# EAGLE design codec_CS42448(rev_A) (EAGLE 9.6.2)

## Sheet 1 of 4
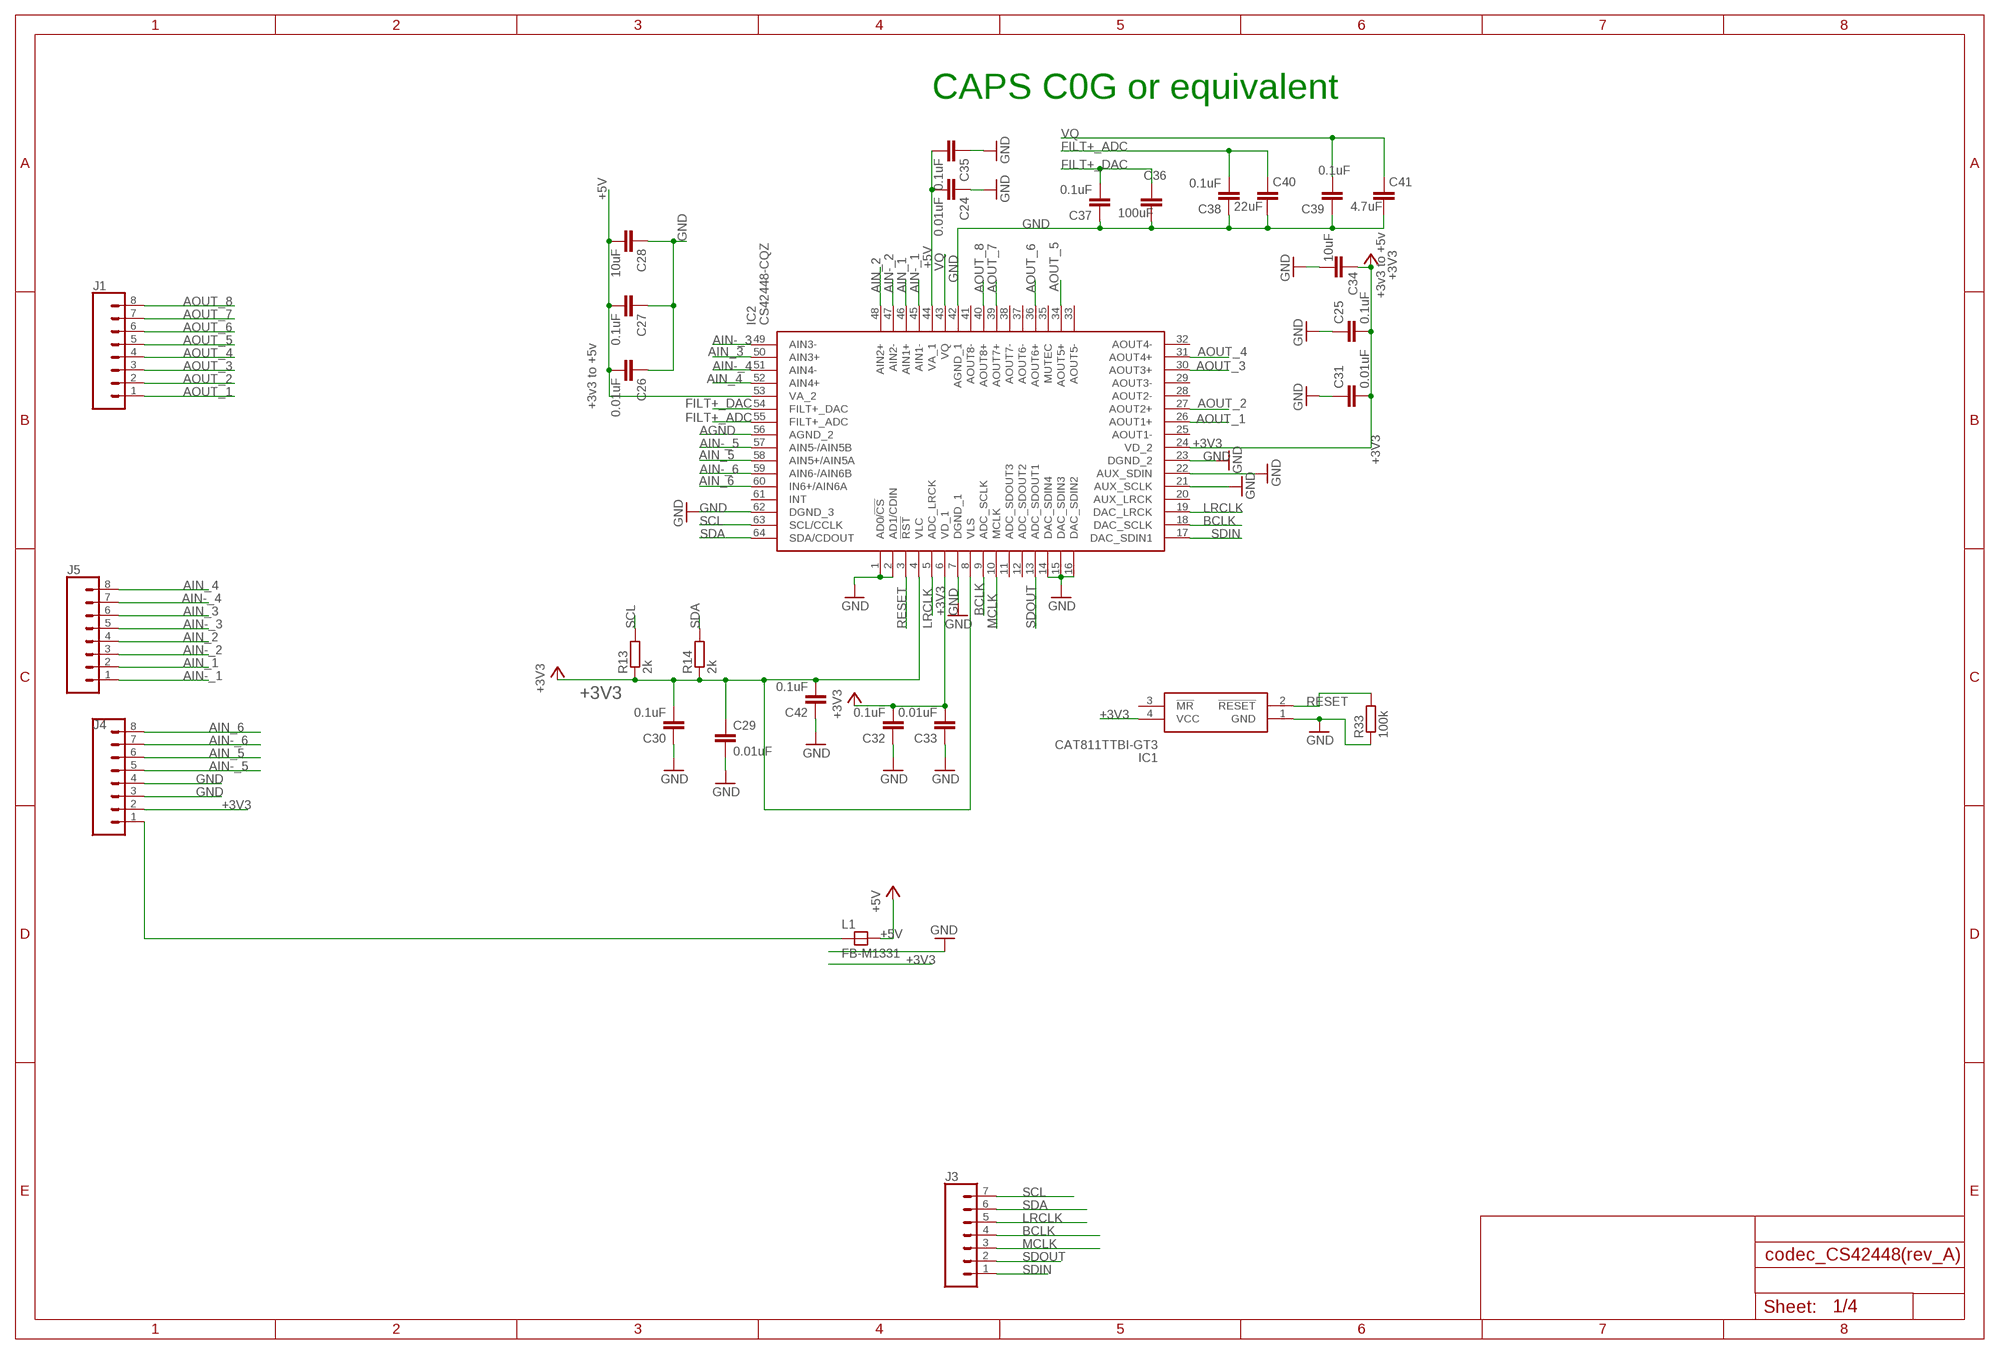
[diagram p0: schematic, sheet 1]

### Parts
C24  0.01uF  C-EUC0805  [C0805]
C25  0.1uF  C-EUC0603  [C0603]
C26  0.01uF  C-EUC0805  [C0805]
C27  0.1uF  C-EUC0603  [C0603]
C28  10uF  C-EUC0805  [C0805]
C29  0.01uF  C-EUC0805  [C0805]
C30  0.1uF  C-EUC0603  [C0603]
C31  0.01uF  C-EUC0805  [C0805]
C32  0.1uF  C-EUC0603  [C0603]
C33  0.01uF  C-EUC0805  [C0805]
C34  10uF  C-EUC0805  [C0805]
C35  0.1uF  C-EUC0603  [C0603]
C36  100uF  C-EUC1206  [C1206]
C37  0.1uF  C-EUC0603  [C0603]
C38  0.1uF  C-EUC0603  [C0603]
C39  0.1uF  C-EUC0603  [C0603]
C40  22uF  C-EUC0805  [C0805]
C41  4.7uF  C-EUC0805  [C0805]
C42  0.1uF  C-EUC0805  [C0805]
IC1  CAT811TTBI-GT3  [4-PIN-SOT-143(BI-SUFFIX-CASE-5]
IC2  CS42448-CQZ  [QFP50P1200X1200X160-64N]
J1  CONN_08"  [1X08]
J3  CONN_07  [1X07]
J4  CONN_08"  [1X08]
J5  CONN_08"  [1X08]
L1  FB-M1331  [M1331]
R13  2k  R-EU_R0603  [R0603]
R14  2k  R-EU_R0603  [R0603]
R33  100k  R-EU_R0603  [R0603]

### Nets
+3V3: C25.2 C29.1 C30.2 C31.2 C32.2 C33.2 C34.1 C42.2 IC1.4(VCC) IC2.4(VLC) IC2.6(VD_1) IC2.8(VLS) IC2.24(VD_2) J4.2 R13.1 R14.1
+5V: C24.2 C26.2 C27.2 C28.2 C35.2 IC2.44(VA_1) IC2.53(VA_2) L1.2
AGND: IC2.56(AGND_2)
AIN-_1: IC2.45(AIN1-) J5.1
AIN-_2: IC2.47(AIN2-) J5.3
AIN-_3: IC2.49(AIN3-) J5.5
AIN-_4: IC2.51(AIN4-) J5.7
AIN-_5: IC2.57(AIN5-/AIN5B) J4.5
AIN-_6: IC2.59(AIN6-/AIN6B) J4.7
AIN_1: IC2.46(AIN1+) J5.2
AIN_2: IC2.48(AIN2+) J5.4
AIN_3: IC2.50(AIN3+) J5.6
AIN_4: IC2.52(AIN4+) J5.8
AIN_5: IC2.58(AIN5+/AIN5A) J4.6
AIN_6: IC2.60(IN6+/AIN6A) J4.8
AOUT_1: IC2.26(AOUT1+) J1.1
AOUT_2: IC2.27(AOUT2+) J1.2
AOUT_3: IC2.30(AOUT3+) J1.3
AOUT_4: IC2.31(AOUT4+) J1.4
AOUT_5: IC2.34(AOUT5+) J1.5
AOUT_6: IC2.36(AOUT6+) J1.6
AOUT_7: IC2.39(AOUT7+) J1.7
AOUT_8: IC2.40(AOUT8+) J1.8
BCLK: IC2.9(ADC_SCLK) IC2.18(DAC_SCLK) J3.4
FILT+_ADC: C38.2 C40.1 IC2.55(FILT+_ADC)
FILT+_DAC: C36.1 C37.2 IC2.54(FILT+_DAC)
GND: C24.1 C25.1 C26.1 C27.1 C28.1 C29.2 C30.1 C31.1 C32.1 C33.1 C34.2 C35.1 C36.2 C37.1 C38.1 C39.1 C40.2 C41.2 C42.1 IC1.1(GND) IC2.1(AD0/!CS) IC2.2(AD1/CDIN) IC2.7(DGND_1) IC2.14(DAC_SDIN4) IC2.15(DAC_SDIN3) IC2.16(DAC_SDIN2) IC2.21(AUX_SCLK) IC2.22(AUX_SDIN) IC2.23(DGND_2) IC2.42(AGND_1) IC2.62(DGND_3) J4.3 J4.4 R33.1
LRCLK: IC2.5(ADC_LRCK) IC2.19(DAC_LRCK) J3.5
MCLK: IC2.10(MCLK) J3.3
N$1: J4.1 L1.1
RESET: IC1.2(!RESET) IC2.3(!RST) R33.2
SCL: IC2.63(SCL/CCLK) J3.7 R13.2
SDA: IC2.64(SDA/CDOUT) J3.6 R14.2
SDIN: IC2.17(DAC_SDIN1) J3.1
SDOUT: IC2.13(ADC_SDOUT1) J3.2
VQ: C39.2 C41.1 IC2.43(VQ)
Unconnected: IC1.3(!MR) IC2.11(ADC_SDOUT3) IC2.12(ADC_SDOUT2) IC2.20(AUX_LRCK) IC2.25(AOUT1-) IC2.28(AOUT2-) IC2.29(AOUT3-) IC2.32(AOUT4-) IC2.33(AOUT5-) IC2.35(MUTEC) IC2.37(AOUT6-) IC2.38(AOUT7-) IC2.41(AOUT8-) IC2.61(INT)

### Notes on the sheet
- CAPS C0G or equivalent
- +3v3 to +5v
- +3v3 to +5v

## Sheet 2 of 4
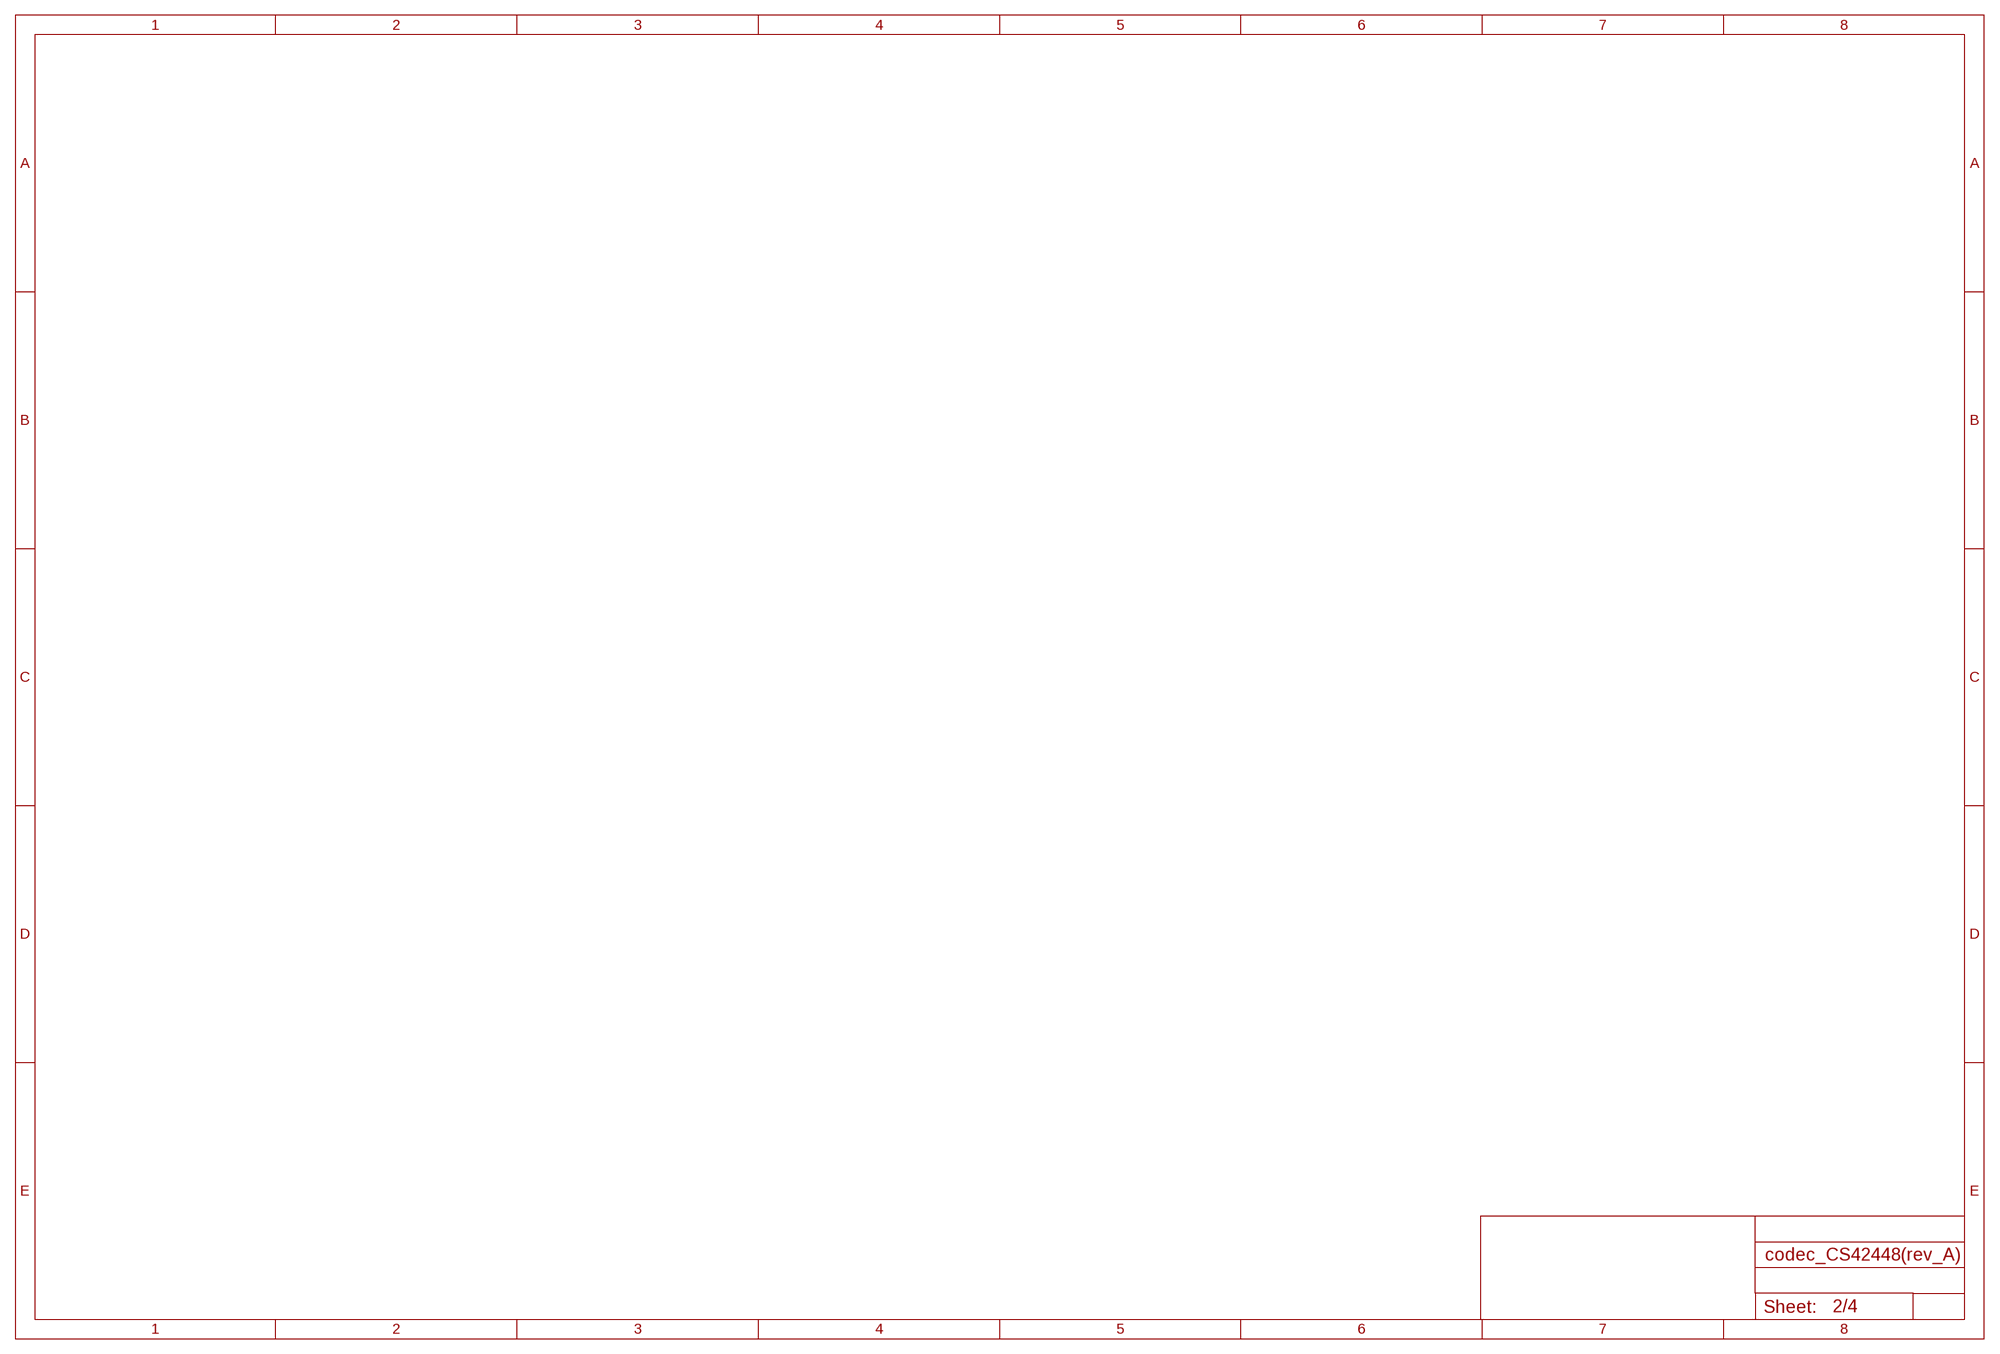
[diagram p1: schematic, sheet 2]

## Sheet 3 of 4
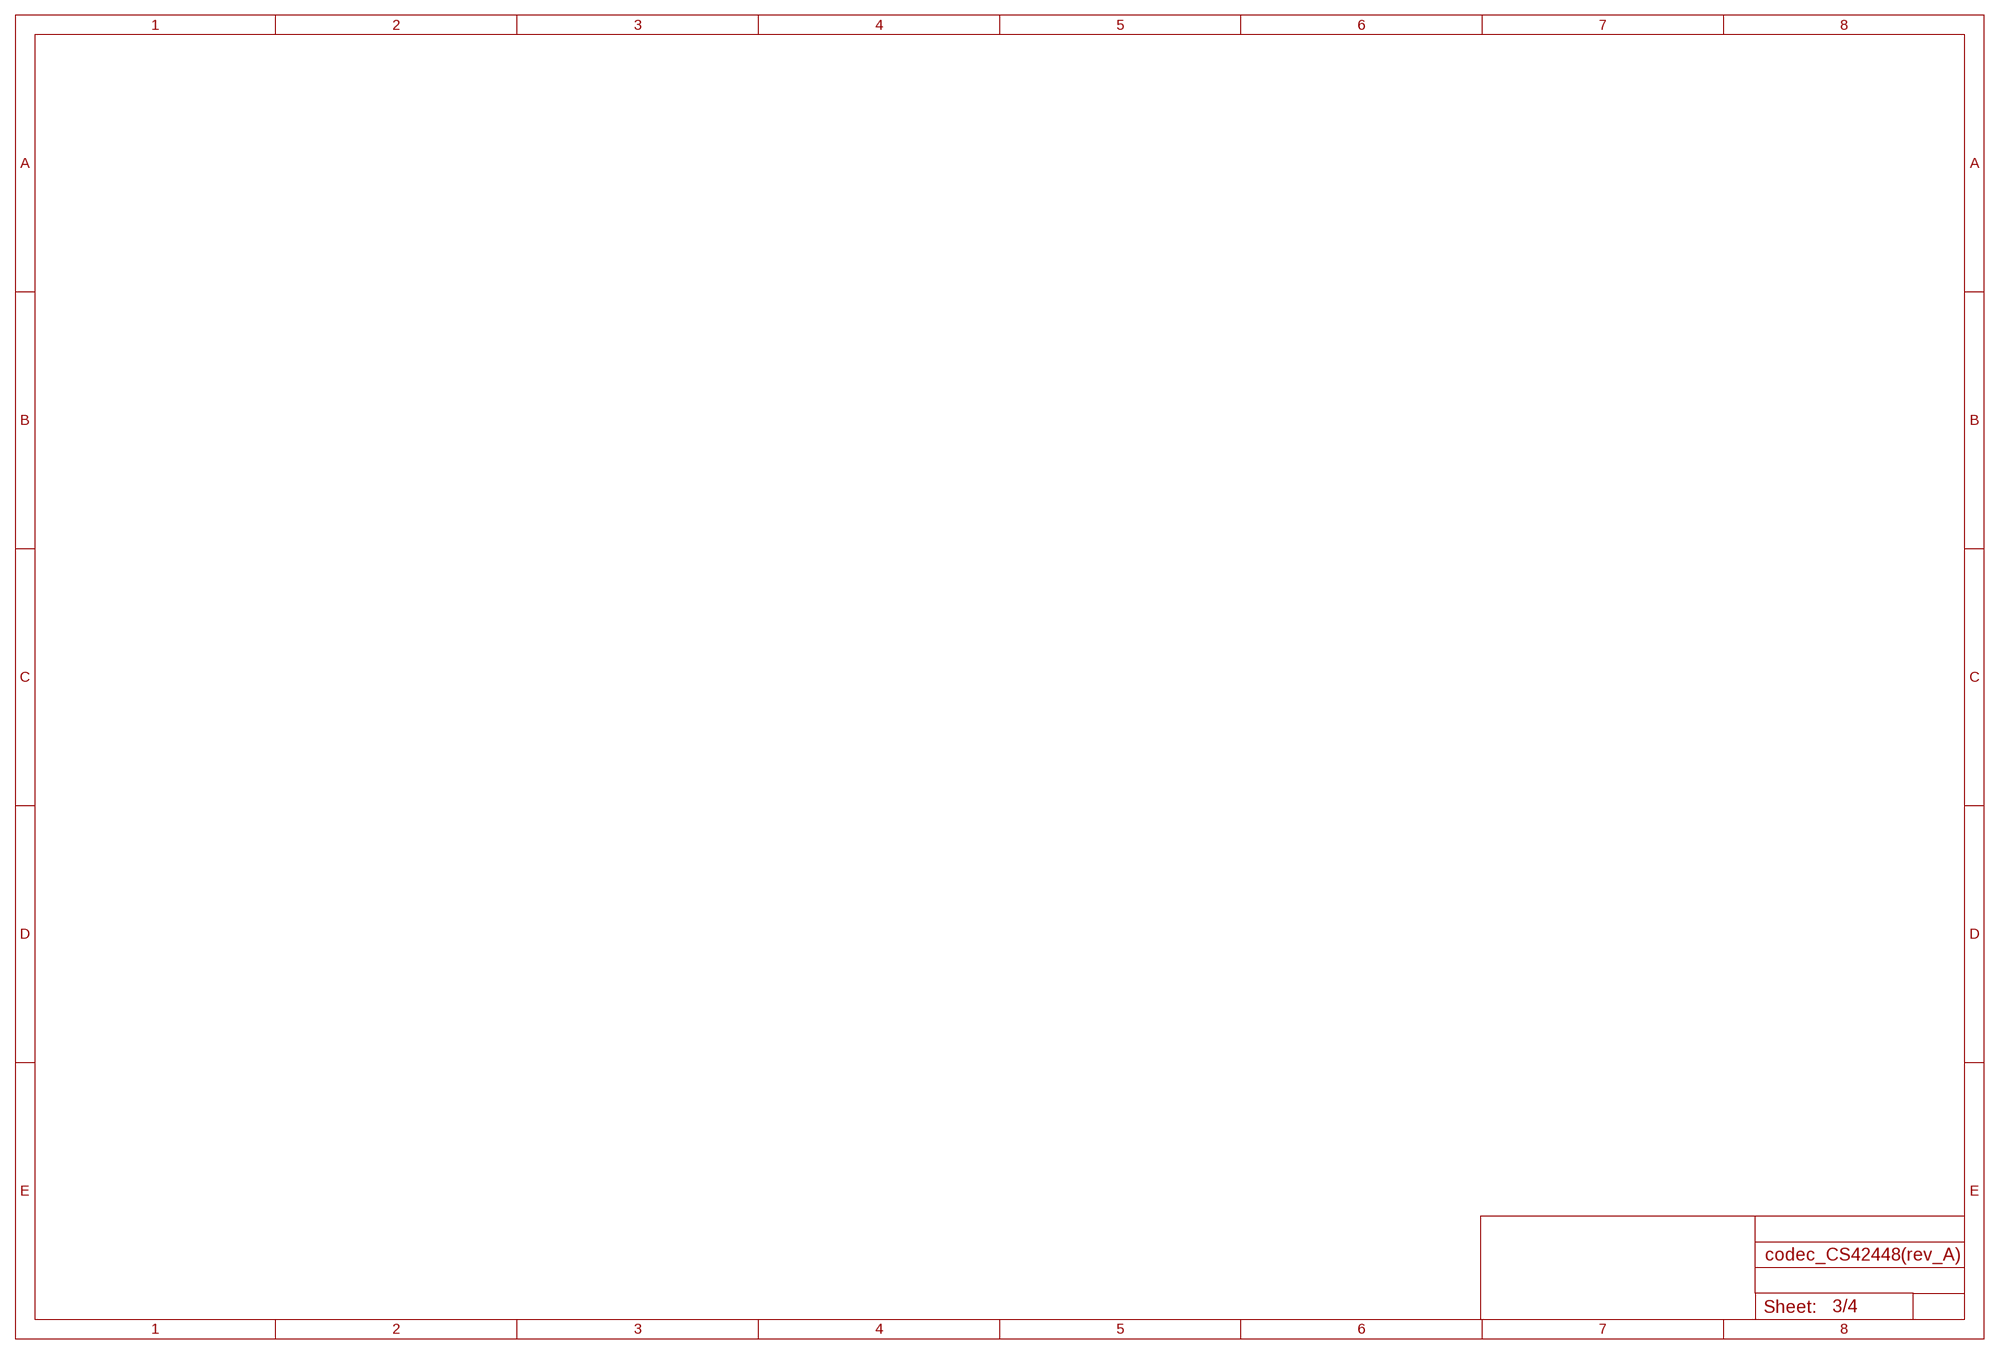
[diagram p2: schematic, sheet 3]

## Sheet 4 of 4
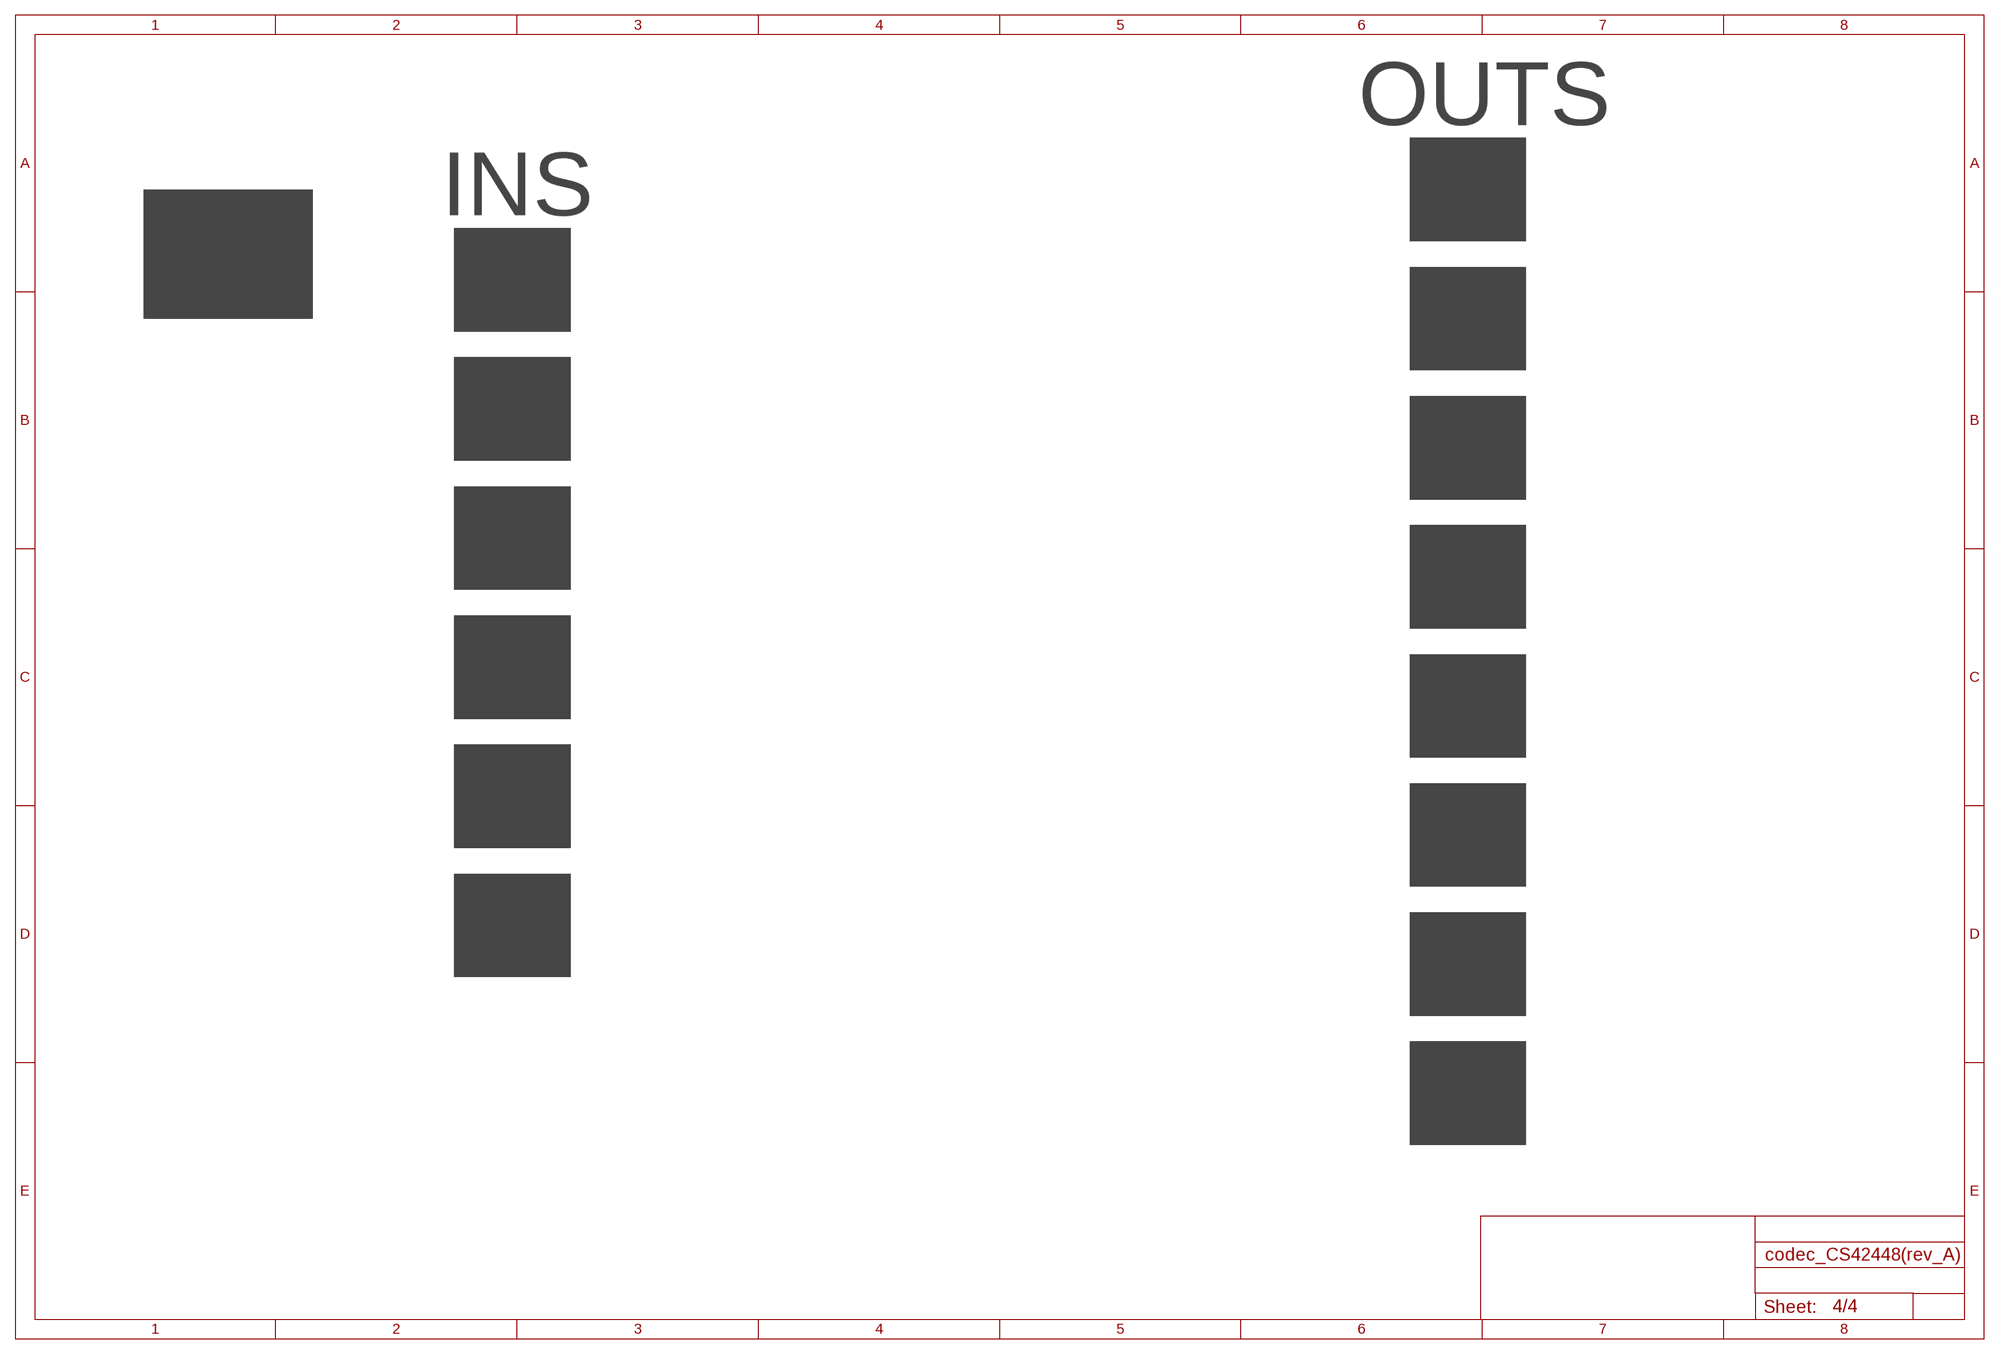
[diagram p3: schematic, sheet 4]

### Notes on the sheet
- OUTS
- INS

## Library data of the parts
C24-C42 = rcl:C-EU: CAPACITOR, European symbol; SPICEPREFIX: C
IC1 = MusicThingModular:CAT811TTBI-GT3: uP PSU Supervisory IC Vth=3.075V SOT-143 ON Semiconductor CAT811TTBI-GT3, Voltage Supervisor 2.5V, 3V, 3.3V, 5V, Reset Input, 4-Pin SOT-143 Source: Datasheet <http://www.onsemi.com/pub/Collateral/CAT811-D.PDF>; ARROW_PART_NUMBER: CAT811TTBI-GT3; ARROW_PRICE-STOCK: https://www.arrow.com/en/products/cat811ttbi-gt3/on-semiconductor?region=nac; DESCRIPTION: uP PSU Supervisory IC Vth=3.075V SOT-143 ON Semiconductor CAT811TTBI-GT3, Voltage Supervisor 2.5V, 3V, 3.3V, 5V, Reset Input, 4-Pin SOT-143; HEIGHT: mm; MANUFACTURER_NAME: ON Semiconductor; MANUFACTURER_PART_NUMBER: CAT811TTBI-GT3; MOUSER_PART_NUMBER: 698-CAT811TTBI-GT3; MOUSER_PRICE-STOCK: https://www.mouser.co.uk/ProductDetail/onsemi/CAT811TTBI-GT3?qs=uDmhV2jwPRcoUWDTAizusg%3D%3D
IC2 = MusicThingModular:CS42448-CQZ: Interface - CODECs 6-In 8-Out CODEC 108 dB 192 kHz Source: Datasheet <http://www.mouser.com/datasheet/2/76/CS42448_F5-1141475.pdf>; DESCRIPTION: Interface - CODECs 6-In 8-Out CODEC 108 dB 192 kHz; HEIGHT: 1.6mm; MANUFACTURER_NAME: Cirrus Logic; MANUFACTURER_PART_NUMBER: CS42448-CQZ; MOUSER_PART_NUMBER: 777-CS42448-CQZ; MOUSER_PRICE-STOCK: https://www.mouser.co.uk/ProductDetail/Cirrus-Logic/CS42448-CQZ?qs=bUPhaerQQeGUnfo%252BYCcmZw%3D%3D
J1 J4 J5 = SparkFun-Connectors:CONN_08: Multi connection point. Often used as Generic Header-pin footprint for 0.1 inch spaced/style header connections On any of the 0.1 inch spaced packages, you can populate with these: Break Away Headers - Straight <https://www.sparkfun.com/products/116> (PRT-00116) Break Away Male Headers - Right Angle <https://www.sparkfun.com/products/553> (PRT-00553) Female Headers <https://www.sparkfun.com/products/115> (PRT-00115) Break Away Headers - Machine Pin <https://www.sparkfun.com/products/117> (PRT-00117) Break Away Female Headers - Swiss Machine Pin <https://www.sparkfun.com/products/743> (PRT-00743) Arduino Stackable Header - 8 Pin <https://www.sparkfun.com/products/9279> (PRT-09279) For SCREWTERMINALS and SPRING TERMINALS visit here: Screw Terimnals on SparkFun.com <https://www.sparkfun.com/search/results?term=Screw+Terminals> (5mm/3.5mm/2.54mm spacing) This device is also useful as a general connection point to wire up your design to another part of your project. Our various solder wires solder well into these plated through hole pads. Hook-Up Wire - Assortment (Stranded, 22 AWG) <https://www.sparkfun.com/products/11375> (PRT-11375) Hook-Up Wire - Assortment (Solid Core, 22 AWG) <https://www.sparkfun.com/products/11367> (PRT-11367) View the entire wire category on our website here <https://www.sparkfun.com/categories/141> Special notes: Molex polarized connector foot print use with SKU : PRT-08231 with associated crimp pins and housings. 1MM SMD Version SKU: PRT-10208 NOTES ON THE VARIANTS LOCK and LOCK_LONGPADS... This footprint was designed to help hold the alignment of a through-hole component (i.e. 6-pin header) while soldering it into place. You may notice that each hole has been shifted either up or down by 0.005 of an inch from it's more standard position (which is a perfectly straight line). This slight alteration caused the pins (the squares in the middle) to touch the edges of the holes. Because they are alternating, it causes a "brace" to hold the component in place. 0.005 has proven to be the perfect amount of "off-center" position when using our standard breakaway headers. Although looks a little odd when you look at the bare footprint, once you have a header in there, the alteration is very hard to notice. Also,if you push a header all the way into place, it is covered up entirely on the bottom side.; PROD_ID: CONN-08438
J3 = SparkFun-Connectors:CONN_07: Multi connection point. Often used as Generic Header-pin footprint for 0.1 inch spaced/style header connections On any of the 0.1 inch spaced packages, you can populate with these: Break Away Headers - Straight <https://www.sparkfun.com/products/116> (PRT-00116) Break Away Male Headers - Right Angle <https://www.sparkfun.com/products/553> (PRT-00553) Female Headers <https://www.sparkfun.com/products/115> (PRT-00115) Break Away Headers - Machine Pin <https://www.sparkfun.com/products/117> (PRT-00117) Break Away Female Headers - Swiss Machine Pin <https://www.sparkfun.com/products/743> (PRT-00743) For SCREWTERMINALS and SPRING TERMINALS visit here: Screw Terimnals on SparkFun.com <https://www.sparkfun.com/search/results?term=Screw+Terminals> (5mm/3.5mm/2.54mm spacing) This device is also useful as a general connection point to wire up your design to another part of your project. Our various solder wires solder well into these plated through hole pads. Hook-Up Wire - Assortment (Stranded, 22 AWG) <https://www.sparkfun.com/products/11375> (PRT-11375) Hook-Up Wire - Assortment (Solid Core, 22 AWG) <https://www.sparkfun.com/products/11367> (PRT-11367) View the entire wire category on our website here <https://www.sparkfun.com/categories/141> Special notes: Molex polarized connector foot print use with SKU : PRT-08231 with associated crimp pins and housings. 1MM SMD Version SKU: PRT-10208 NOTES ON THE VARIANTS LOCK and LOCK_LONGPADS... This footprint was designed to help hold the alignment of a through-hole component (i.e. 6-pin header) while soldering it into place. You may notice that each hole has been shifted either up or down by 0.005 of an inch from it's more standard position (which is a perfectly straight line). This slight alteration caused the pins (the squares in the middle) to touch the edges of the holes. Because they are alternating, it causes a "brace" to hold the component in place. 0.005 has proven to be the perfect amount of "off-center" position when using our standard breakaway headers. Although looks a little odd when you look at the bare footprint, once you have a header in there, the alteration is very hard to notice. Also,if you push a header all the way into place, it is covered up entirely on the bottom side.
L1 = inductors-jwmiller:FB: FERRITE BEAD
R13 R14 R33 = rcl:R-EU_: RESISTOR, European symbol; SPICEPREFIX: R

## Board
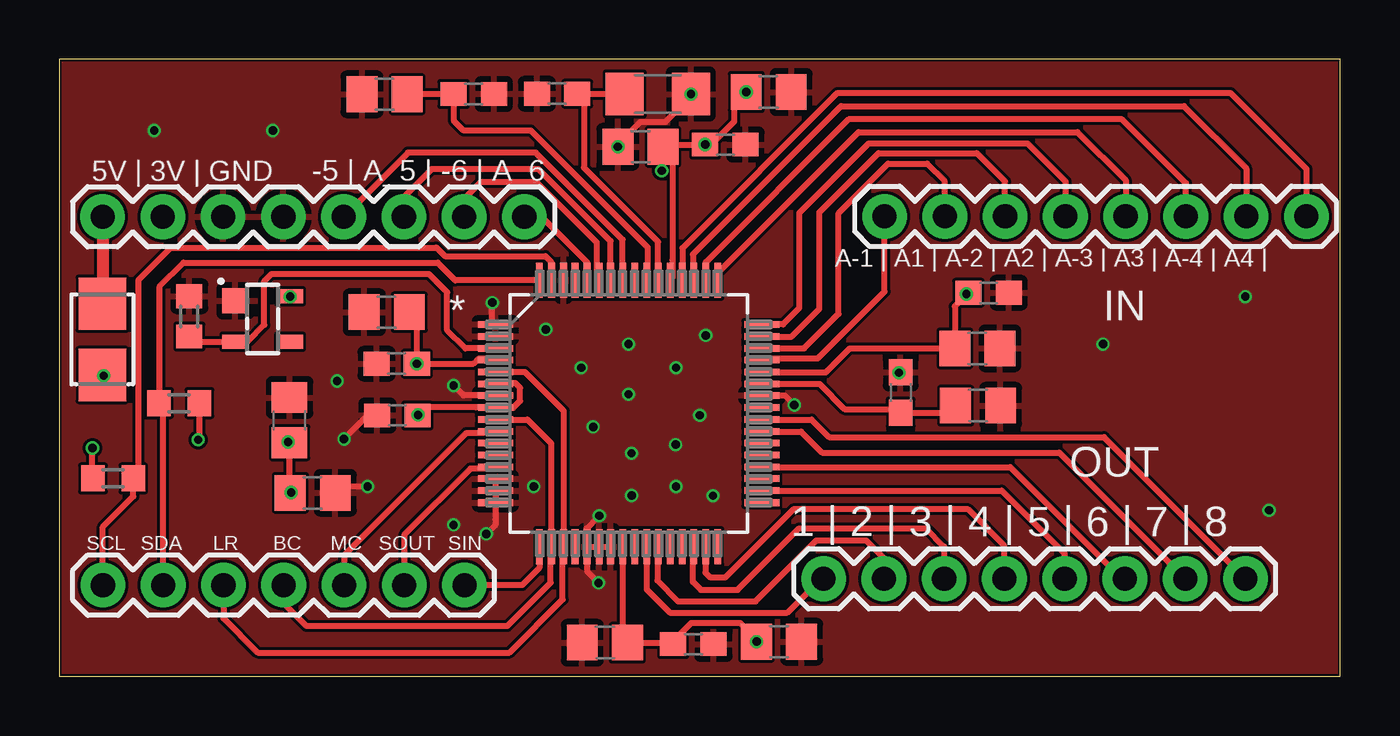
[diagram p4: board, top side]
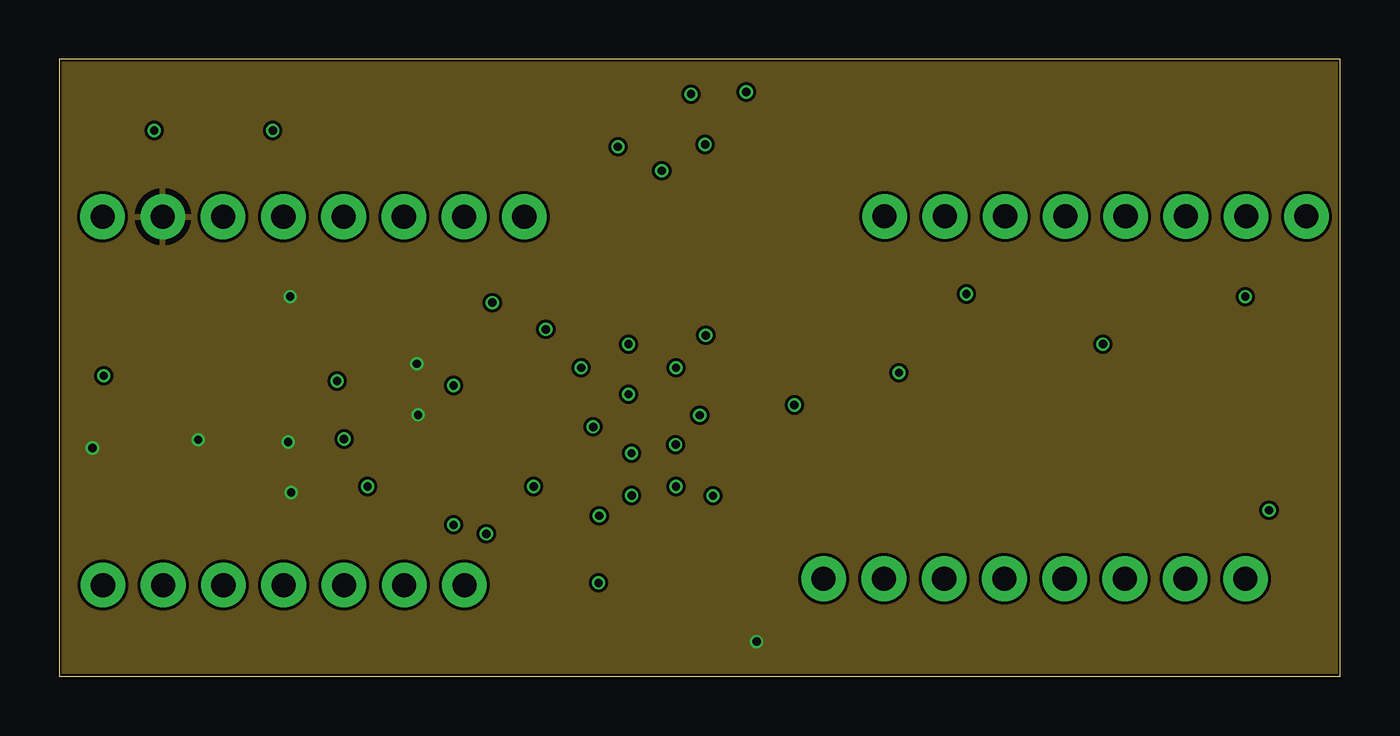
[diagram p5: board, inner layer Route2]
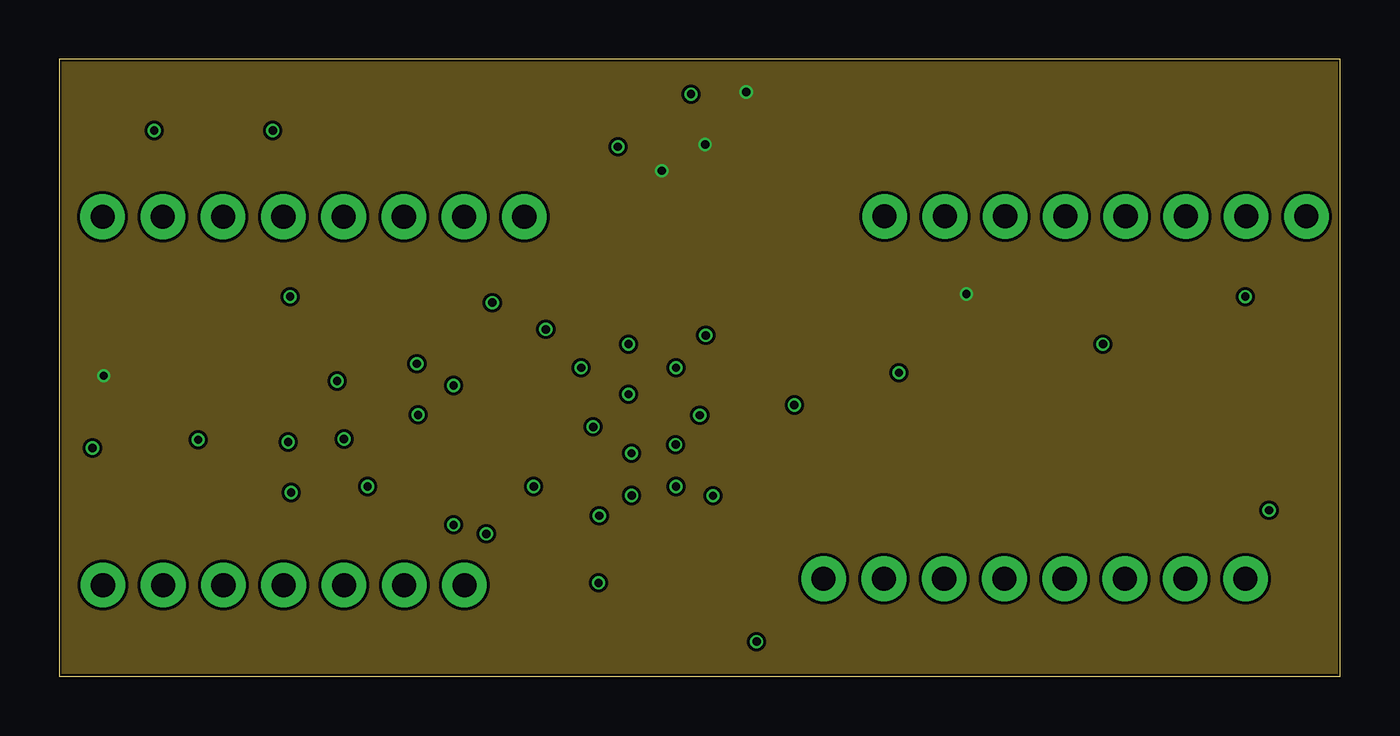
[diagram p6: board, inner layer Route15]
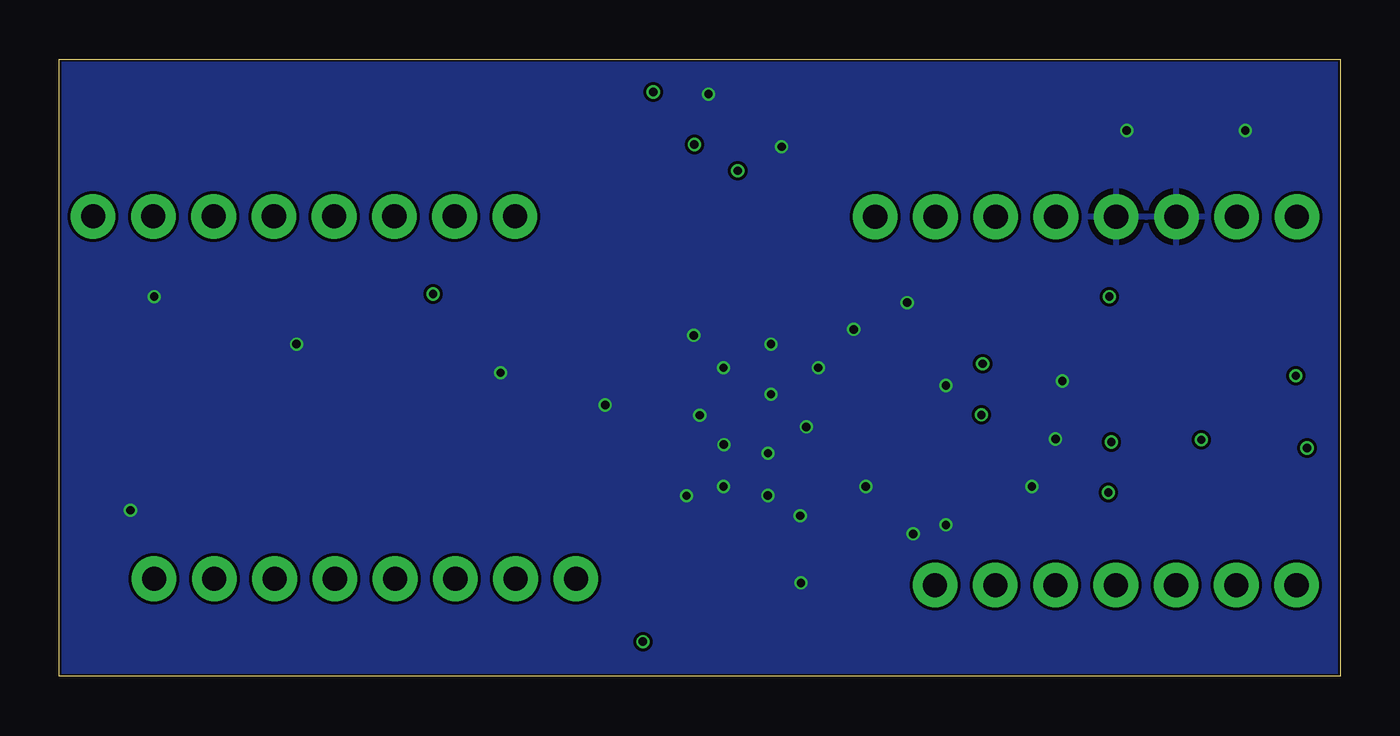
[diagram p7: board, bottom side, seen from below]

Size 54 x 26 mm. Coordinates in mm from the lower left corner, seen from the top.
Outline: 0,0 54,0 54,26 0,26 0,0
Copper layers (1*2*15*16): Top 0.035559375mm / dielectric 0.17018125mm / Route2 0.01778125mm / dielectric 47mil / Route15 0.01778125mm / dielectric 0.17018125mm / Bottom 0.035559375mm
Design rules "jlcpcb-4-layer": minimum track width 5mil, minimum drill 0.2mm, track to track 0.126490625mm, track to pad 0.126490625mm, pad to pad 0.126490625mm, via to via 0.126490625mm, smd to smd 0mil, copper to edge 0.1mm, drill to drill 5mil, minimum pad ring 4mil, minimum via ring 4mil, stop-mask expansion 3mil, vias tented up to drill 100mil, thermal gap 10mil

### Footprints (pad centres in the part's own frame; a part is rotated, then mirrored left to right if it is on the bottom)
C0805 = smd 1.3 x 1.5: 1 -0.95,0; 2 0.95,0
C0603 = smd 1.1 x 1: 1 -0.85,0; 2 0.85,0
C1206 = smd 1.6 x 1.8: 1 -1.4,0; 2 1.4,0
4-PIN-SOT-143(BI-SUFFIX-CASE-5 = smd 1.05 x 1.1: 1 -0.76,-1.15 | smd 0.6 x 1.1: 2 0.96,-1.15; 3 0.96,1.15; 4 -0.96,1.15
QFP50P1200X1200X160-64N = smd 1.473 x 0.279: 1 -5.613,3.759; 2 -5.613,3.251; 3 -5.613,2.743; 4 -5.613,2.261; 5 -5.613,1.753; 6 -5.613,1.245; 7 -5.613,0.762; 8 -5.613,0.254; 9 -5.613,-0.254; 10 -5.613,-0.762; 11 -5.613,-1.245; 12 -5.613,-1.753; 13 -5.613,-2.261; 14 -5.613,-2.743; 15 -5.613,-3.251; 16 -5.613,-3.759; 33 5.613,-3.759; 34 5.613,-3.251; 35 5.613,-2.743; 36 5.613,-2.261; 37 5.613,-1.753; 38 5.613,-1.245; 39 5.613,-0.762; 40 5.613,-0.254; 41 5.613,0.254; 42 5.613,0.762; 43 5.613,1.245; 44 5.613,1.753; 45 5.613,2.261; 46 5.613,2.743; 47 5.613,3.251; 48 5.613,3.759 | smd 0.279 x 1.473: 17 -3.759,-5.613; 18 -3.251,-5.613; 19 -2.743,-5.613; 20 -2.261,-5.613; 21 -1.753,-5.613; 22 -1.245,-5.613; 23 -0.762,-5.613; 24 -0.254,-5.613; 25 0.254,-5.613; 26 0.762,-5.613; 27 1.245,-5.613; 28 1.753,-5.613; 29 2.261,-5.613; 30 2.743,-5.613; 31 3.251,-5.613; 32 3.759,-5.613; 49 3.759,5.613; 50 3.251,5.613; 51 2.743,5.613; 52 2.261,5.613; 53 1.753,5.613; 54 1.245,5.613; 55 0.762,5.613; 56 0.254,5.613; 57 -0.254,5.613; 58 -0.762,5.613; 59 -1.245,5.613; 60 -1.753,5.613; 61 -2.261,5.613; 62 -2.743,5.613; 63 -3.251,5.613; 64 -3.759,5.613
1X08 = drill 1.016 pad 1.88: 1 0,0; 2 2.54,0; 3 5.08,0; 4 7.62,0; 5 10.16,0; 6 12.7,0; 7 15.24,0; 8 17.78,0
1X07 = drill 1.016 pad 1.88: 1 0,0; 2 2.54,0; 3 5.08,0; 4 7.62,0; 5 10.16,0; 6 12.7,0; 7 15.24,0
M1331 = smd 2.2 x 2: 1 -1.5,0; 2 1.5,0
R0603 = smd 1 x 1.1: 1 -0.85,0; 2 0.85,0

### Placement (x,y rotation side)
C24  38.7,13.82 180 top
C25  26.73,1.36 180 top
C26  24.5,22.32 0 top
C27  28.08,22.41 180 top
C28  29.91,24.62 180 top
C29  13.81,15.34 180 top
C30  14.22,13.17 0 top
C31  23,1.42 0 top
C32  14.25,10.99 0 top
C33  9.71,10.8 270 top
C34  30.34,1.45 0 top
C35  39.18,16.16 180 top
C36  25.23,24.54 0 top
C37  20.98,24.55 0 top
C38  17.47,24.54 180 top
C39  35.47,11.96 270 top
C40  13.71,24.53 180 top
C41  38.73,11.41 0 top
C42  10.69,7.73 180 top
IC1  8.57,15.06 270 top
IC2  24,11.07 0 top
J1  32.22,4.11 0 top
J3  17.08,3.84 180 top
J4  1.83,19.36 0 top
J5  34.79,19.38 0 top
L1  1.81,14.2 270 top
R13  2.27,8.34 0 top
R14  5.05,11.51 180 top
R33  5.48,15.17 270 top

### Tracks (layer width: path | path; a pad name or v marks a point on that pad's centre or on a via)
+3V3  (via drill 0.35)
  Top 0.254: IC2.8 17.57,11.33 | IC2.4 18.35,13.37 17.66,13.37 17.46,13.17 C30.2 15.07,15.03 C29.1 | C31.2 24.07,1.29 | IC2.24 23.75,1.62 C31.2 | 9.96,9.59 C33.2 | IC2.8 15.44,11.33 C32.2 v15.13,11.02 | C42.2 10.19,7.73 | C42.2 9.71,7.73 C33.2 | C42.2 9.74,7.82 | v29.4,1.46 C34.1 29.39,1.56 28.71,2.24 26.64,2.24 25.82,1.42 | C42.2 9.76,7.73 v9.78,7.75 | R13.1 1.4,8.37 v1.4,9.62 | IC2.8 18.4,11.31 19.14,11.31 19.43,11.61 19.43,12.16 19.23,12.36 18.43,12.36 IC2.6 | R14.1 5.9,10.01 v5.86,9.97 | C33.2 9.68,9.85 v9.65,9.87 | v9.73,16 v9.72,16.01 IC1.4 | C31.2 25.82,1.42 | 25.82,1.42 C25.2
  other vias: 15.07,13.17
  pour Route2: 0,27 54,27 54,0 0,0
+5V  (via drill 0.35)
  Top 0.254: IC2.44 29.64,12.8 32.31,12.8 33.33,13.82 C24.2 37.76,15.59 C35.2 38.29,16.16 v38.24,16.11 | C26.2 25.85,21.92 25.85,17.54 25.84,17.54 25.84,16.77 IC2.53 | C28.2 28.45,24.11 28.45,23.38 27.48,22.41 C27.2 25.54,22.41 C26.2 | C26.2 25.45,21.35 v25.4,21.3 | L1.2 1.85,12.67 v1.87,12.67
  other vias: 28.96,24.62 27.23,22.41
  pour Route15: 0,27 54,27 54,0 0,0
AIN-_1
  Top 0.254: IC2.45 29.68,13.4 31.98,13.4 34.79,16.21 J5.1
AIN-_2
  Top 0.254: IC2.47 30.88,14.31 32.04,15.48 32.04,19.55 34.54,22.05 38.67,22.05 39.87,20.85 J5.3
AIN-_3
  Top 0.254: J5.5 44.95,20.91 42.92,22.94 33.7,22.94 27.76,17 IC2.49
AIN-_4
  Top 0.254: IC2.51 26.71,16.72 26.71,17.78 32.96,24.03 47.41,24.03 50.03,21.41 J5.7
AIN-_5
  Top 0.254: J4.5 14.7,22.07 20.08,22.07 23.75,18.4 IC2.57
AIN-_6
  Top 0.254: IC2.59 22.67,16.77 22.67,18.28 20.12,20.83 17.77,20.83 17.07,20.13 J4.7
AIN_1
  Top 0.254: IC2.46 31.39,13.82 32.85,15.28 32.85,19.52 34.94,21.61 36.58,21.61 37.33,20.86 J5.2
AIN_2
  Top 0.254: IC2.48 30.51,14.83 31.19,15.51 31.19,19.52 34.12,22.45 40.83,22.45 42.41,20.86 J5.4
AIN_3
  Top 0.254: J5.6 47.49,20.78 44.8,23.47 33.28,23.47 27.25,17.45 IC2.50
AIN_4
  Top 0.254: IC2.52 26.26,18.04 32.81,24.58 49.37,24.58 52.57,21.38 J5.8
AIN_5
  Top 0.254: J4.6 14.53,20.21 15.69,21.37 20.2,21.37 23.24,18.33 IC2.58
AIN_6
  Top 0.254: IC2.60 22.25,17.45 20.33,19.36 J4.8
AOUT_1
  Top 0.254: IC2.26 24.77,3.66 25.74,2.68 30.69,2.68 32.12,4.11 J1.1
AOUT_2
  Top 0.254: IC2.27 25.21,5.42 25.21,4.04 26.09,3.15 29.35,3.15 31.92,5.72 34.01,5.72 34.76,4.97 J1.2
AOUT_3
  Top 0.254: IC2.30 26.71,5.42 26.71,3.98 27.05,3.65 28.6,3.65 31.18,6.23 36.53,6.23 37.3,5.46 J1.3
AOUT_4
  Top 0.254: J1.4 39.84,5.51 38.32,7.03 30.95,7.03 28.07,4.15 27.45,4.15 27.24,4.36 27.24,5.45 IC2.31
AOUT_5
  Top 0.254: IC2.34 39.73,7.82 42.38,5.17 J1.5
AOUT_6
  Top 0.254: IC2.36 40.09,8.81 44.79,4.11 J1.6
AOUT_7
  Top 0.254: IC2.39 31.27,10.31 32.16,9.42 42.15,9.42 J1.7
AOUT_8
  Top 0.254: IC2.40 31.71,10.82 32.45,10.08 44.04,10.08 J1.8
BCLK
  Top 0.152: 20.71,5.42 IC2.18
  Top 0.254: IC2.9 19.74,10.82 20.75,9.8 IC2.18 | J3.4 9.46,3.08 10.41,2.13 18.89,2.13 20.71,3.95 20.71,5.42
FILT+_ADC
  Top 0.254: IC2.55 24.81,16.73 24.81,18.06 19.88,22.99 17.05,22.99 16.62,23.42 C38.2 14.68,24.54 C40.1
FILT+_DAC
  Top 0.254: C36.1 23.84,24.55 C37.2 22.12,24.27 22.12,21.44 25.25,18.3 IC2.54
GND  (via drill 0.35)
  Top 0.254: C39.1 35.41,12.81 v35.4,12.79 | C32.1 12.99,10.99 v12,10 | C42.1 11.91,8 v13,8 | 22.25,1.62 C31.1 | IC2.1 18.25,14.97 v18.25,15.75 | IC2.16 18.39,6.61 | IC2.7 17.04,11.84 v16.62,12.25 | 22.26,5.57 22.26,6.17 22.22,6.22 v22.76,6.76 | IC2.16 18.39,6.39 v18,6 | IC2.23 IC2.21 22.25,4.42 v22.73,3.94 | IC2.42 30.58,11.84 v30.99,11.43 | IC2.14 IC2.16 | C36.2 26.63,24.43 25.55,23.35 24.48,23.35 23.55,22.42 C26.1
  Bottom 0.254: v16.62,12.25 16.75,12.25
  other vias: 4,23 9,23 20.51,14.62 27.25,14.37 20,8 24.13,9.4 16.62,6.38 24,14 22,13 26,13 27,11 22.51,10.51 24,11.89 25.98,9.76 24.13,7.62 26,8 50,16 44,14 51,7 11.71,12.45 27.56,7.61 26.63,24.54 23.55,22.32
  pour Top: 0,27 54.09,27 54.09,0 0,0
  pour Bottom: 0,27 54.14,27 54.14,0 0,0
LRCLK
  Top 0.152: 21.22,5.42 IC2.19
  Top 0.254: IC2.5 19.62,12.83 21.26,11.19 IC2.19 | J3.5 6.92,2.44 8.36,1 18.98,1 21.22,3.24 21.22,5.42
MCLK
  Top 0.254: IC2.10 18.37,10.33 17.95,10.33 17.87,10.25 17.16,10.25 12,5.09 J3.3
N$1
  Top 0.508: J4.1 1.83,15.71 L1.1
RESET
  Top 0.254: R33.2 5.7,14.1 IC1.2 7.93,14.1 8.64,14.81 8.64,16.66 8.94,16.95 15.59,16.95 16.36,16.18 16.36,14.58 17.12,13.82 IC2.3
SCL
  Top 0.254: IC2.63 20.75,17.45 20.5,17.7 16.25,17.7 15.9,18.06 15.88,18.06 15.87,18.06 4.7,18.06 3.33,16.7 3.33,8.55 R13.2 3.12,7.58 1.84,6.3 J3.7
SDA
  Top 0.254: IC2.64 16.7,16.69 15.95,17.43 5.24,17.43 4.21,16.41 4.21,11.53 R14.2 4.38,11.34 J3.6
SDIN
  Top 0.254: IC2.17 20.24,4.57 19.51,3.84 J3.1
SDOUT
  Top 0.254: IC2.13 18.33,8.75 17.33,8.75 14.54,5.96 J3.2
VQ
  Top 0.254: IC2.43 32.05,12.32 33.11,11.26 35.32,11.26 C39.2 37.48,11.11 C41.1

### Text on the board
tNames: 5V | 3V | GND | -5 | A_5 | -6 | A_6 | A-1 | A1 | A-2 | A2 | A-3 | A3 | A-4 | A4 | | IN | OUT | 1 | 2 | 3 | 4 | 5 | 6 | 7 | 8 | SCL | SDA | LR | BC | MC | SOUT | SIN